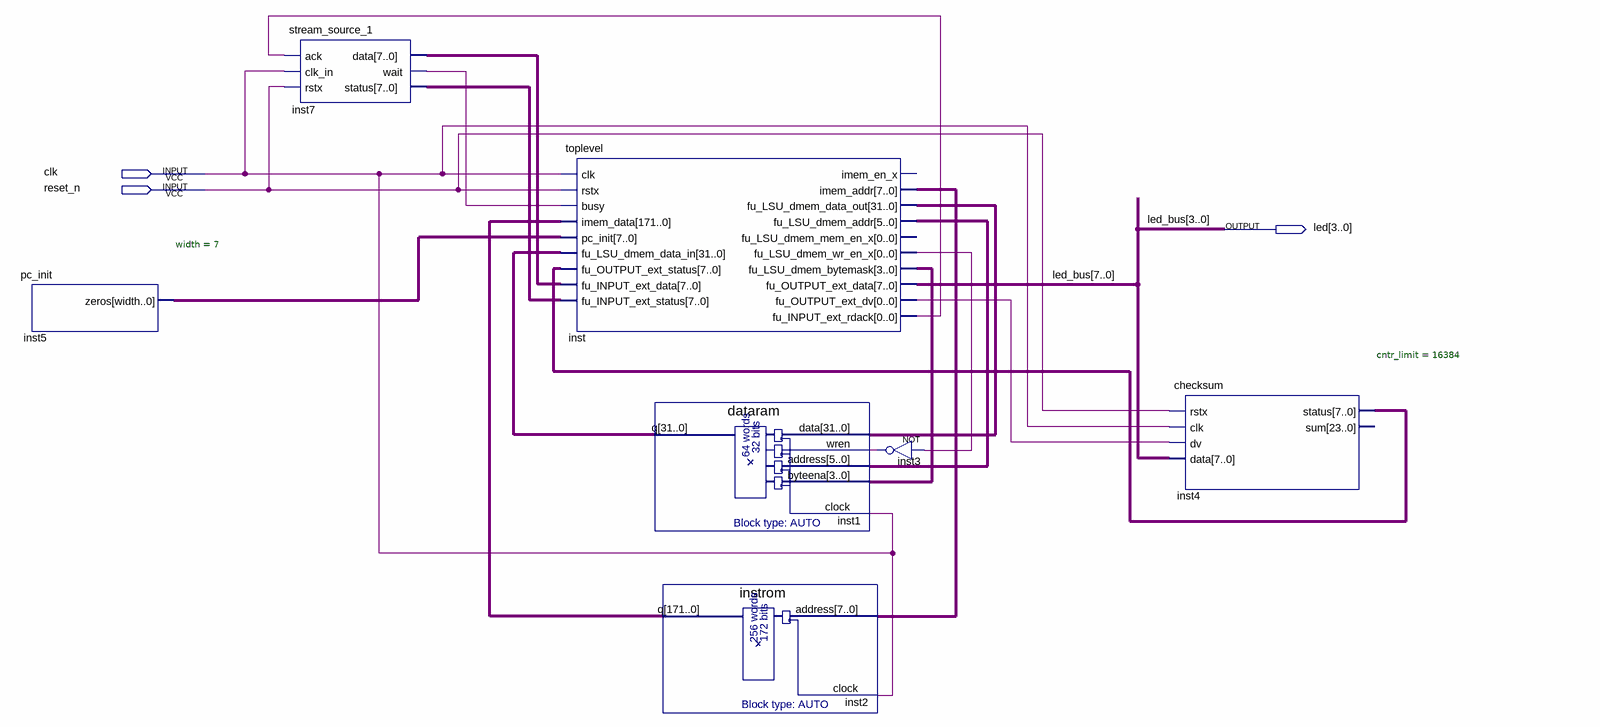
[diagram p0: schematic sheet]
// Quartus schematic tta.bdf as structural Verilog: 7 symbols, 3 pins
module tta (
  input  clk,
  input  reset_n,
  output [3:0] led
);

  wire inst3_out, inst7_wait, inst_fu_input_ext_rdack, inst_fu_lsu_dmem_wr_en_x, inst_fu_output_ext_dv;
  wire [3:0] inst_fu_lsu_dmem_bytemask;
  wire [5:0] inst_fu_lsu_dmem_addr;
  wire [7:0] inst4_status, inst5_zeros, inst7_data, inst7_status, inst_imem_addr;
  wire [7:4] led_bus;
  wire [31:0] inst1_q, inst_fu_lsu_dmem_data_out;
  wire [171:0] inst2_q;

  pc_init #(.width(7)) inst5 (.zeros(inst5_zeros));
  stream_source_1 inst7 (
    .ack(inst_fu_input_ext_rdack), .clk_in(clk), .rstx(reset_n), .data(inst7_data), .\wait (inst7_wait),
    .status(inst7_status));
  toplevel inst (
    .clk(clk), .rstx(reset_n), .busy(inst7_wait), .imem_data(inst2_q), .pc_init(inst5_zeros),
    .fu_LSU_dmem_data_in(inst1_q), .fu_OUTPUT_ext_status(inst4_status), .fu_INPUT_ext_data(inst7_data),
    .fu_INPUT_ext_status(inst7_status), .imem_addr(inst_imem_addr),
    .fu_LSU_dmem_data_out(inst_fu_lsu_dmem_data_out), .fu_LSU_dmem_addr(inst_fu_lsu_dmem_addr),
    .fu_LSU_dmem_wr_en_x(inst_fu_lsu_dmem_wr_en_x), .fu_LSU_dmem_bytemask(inst_fu_lsu_dmem_bytemask),
    .fu_OUTPUT_ext_data({led_bus, led}), .fu_OUTPUT_ext_dv(inst_fu_output_ext_dv),
    .fu_INPUT_ext_rdack(inst_fu_input_ext_rdack));  // open: imem_en_x, fu_LSU_dmem_mem_en_x
  dataram inst1 (
    .data(inst_fu_lsu_dmem_data_out), .wren(inst3_out), .address(inst_fu_lsu_dmem_addr),
    .byteena(inst_fu_lsu_dmem_bytemask), .clock(clk), .q(inst1_q));
  instrom inst2 (.address(inst_imem_addr), .clock(clk), .q(inst2_q));
  not inst3 (inst3_out, inst_fu_lsu_dmem_wr_en_x);
  checksum #(.cntr_limit(16384)) inst4 (
    .rstx(reset_n), .clk(clk), .dv(inst_fu_output_ext_dv), .data({led_bus, led}), .status(inst4_status));  // open: sum

  // Other names for the same wires on the sheet: led_bus[3:0] = led
endmodule
